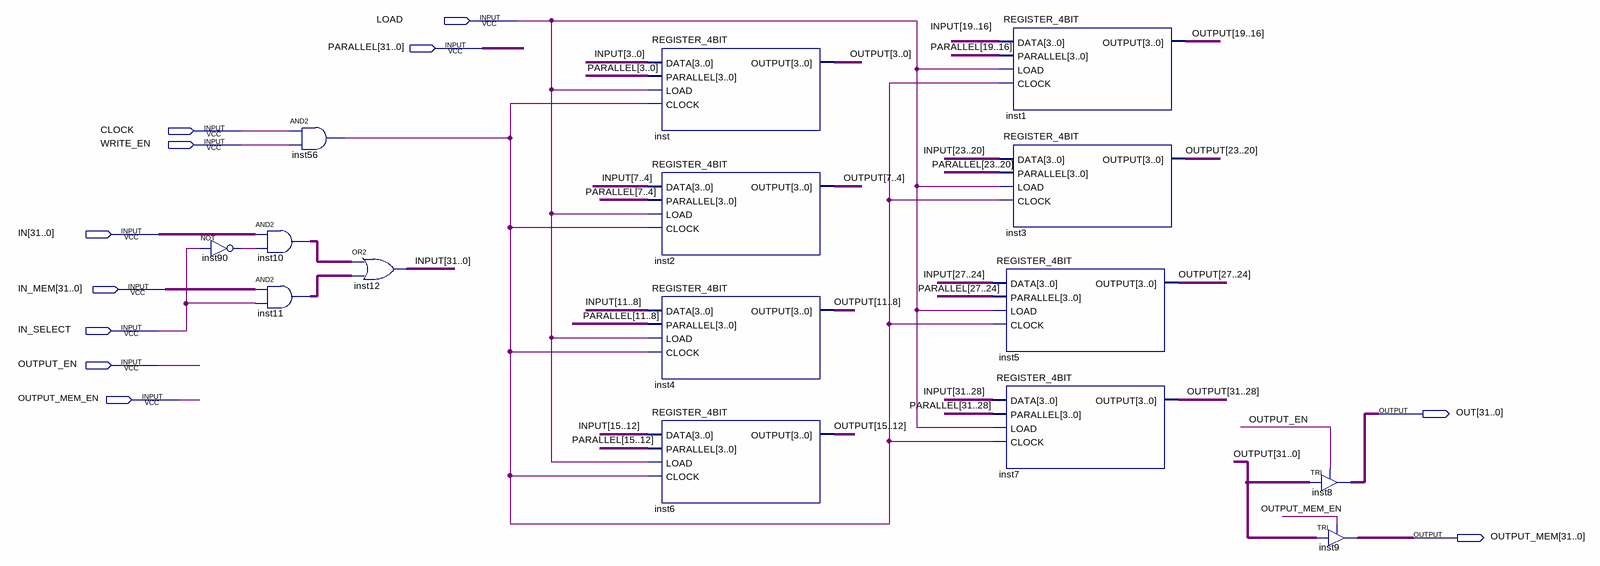
[diagram p0: schematic sheet]
// Quartus schematic REGISTER_32BIT.bdf as structural Verilog: 15 symbols, 11 pins
module REGISTER_32BIT (
  input  LOAD,
  input  [31:0] PARALLEL,
  input  CLOCK,
  input  WRITE_EN,
  input  [31:0] IN,
  input  [31:0] IN_MEM,
  input  IN_SELECT,
  input  OUTPUT_EN,
  input  OUTPUT_MEM_EN,
  output [31:0] OUT,
  output [31:0] OUTPUT_MEM
);

  wire inst56_out, inst90_out;
  wire [31:0] INPUT, inst10_out, inst11_out, OUTPUT;

  not inst90 (inst90_out, IN_SELECT);
  assign inst10_out = IN & {32{inst90_out}};  // AND2 inst10, 32 bits wide
  assign inst11_out = IN_MEM & {32{IN_SELECT}};  // AND2 inst11, 32 bits wide
  and inst56 (inst56_out, CLOCK, WRITE_EN);
  assign INPUT = inst10_out | inst11_out;  // OR2 inst12, 32 bits wide
  REGISTER_4BIT inst (
    .DATA(INPUT[3:0]), .PARALLEL(PARALLEL[3:0]), .LOAD(LOAD), .CLOCK(inst56_out), .OUTPUT(OUTPUT[3:0]));
  REGISTER_4BIT inst2 (
    .DATA(INPUT[7:4]), .PARALLEL(PARALLEL[7:4]), .LOAD(LOAD), .CLOCK(inst56_out), .OUTPUT(OUTPUT[7:4]));
  REGISTER_4BIT inst4 (
    .DATA(INPUT[11:8]), .PARALLEL(PARALLEL[11:8]), .LOAD(LOAD), .CLOCK(inst56_out), .OUTPUT(OUTPUT[11:8]));
  REGISTER_4BIT inst6 (
    .DATA(INPUT[15:12]), .PARALLEL(PARALLEL[15:12]), .LOAD(LOAD), .CLOCK(inst56_out), .OUTPUT(OUTPUT[15:12]));
  REGISTER_4BIT inst5 (
    .DATA(INPUT[27:24]), .PARALLEL(PARALLEL[27:24]), .LOAD(LOAD), .CLOCK(inst56_out), .OUTPUT(OUTPUT[27:24]));
  REGISTER_4BIT inst7 (
    .DATA(INPUT[31:28]), .PARALLEL(PARALLEL[31:28]), .LOAD(LOAD), .CLOCK(inst56_out), .OUTPUT(OUTPUT[31:28]));
  REGISTER_4BIT inst1 (
    .DATA(INPUT[19:16]), .PARALLEL(PARALLEL[19:16]), .LOAD(LOAD), .CLOCK(inst56_out), .OUTPUT(OUTPUT[19:16]));
  REGISTER_4BIT inst3 (
    .DATA(INPUT[23:20]), .PARALLEL(PARALLEL[23:20]), .LOAD(LOAD), .CLOCK(inst56_out), .OUTPUT(OUTPUT[23:20]));
  TRI inst8[31:0] (.IN(OUTPUT), .OE(OUTPUT_EN), .OUT(OUT));
  TRI inst9[31:0] (.IN(OUTPUT), .OE(OUTPUT_MEM_EN), .OUT(OUTPUT_MEM));
endmodule
